# Altium project PCB_HeartRateBand.PrjPcb
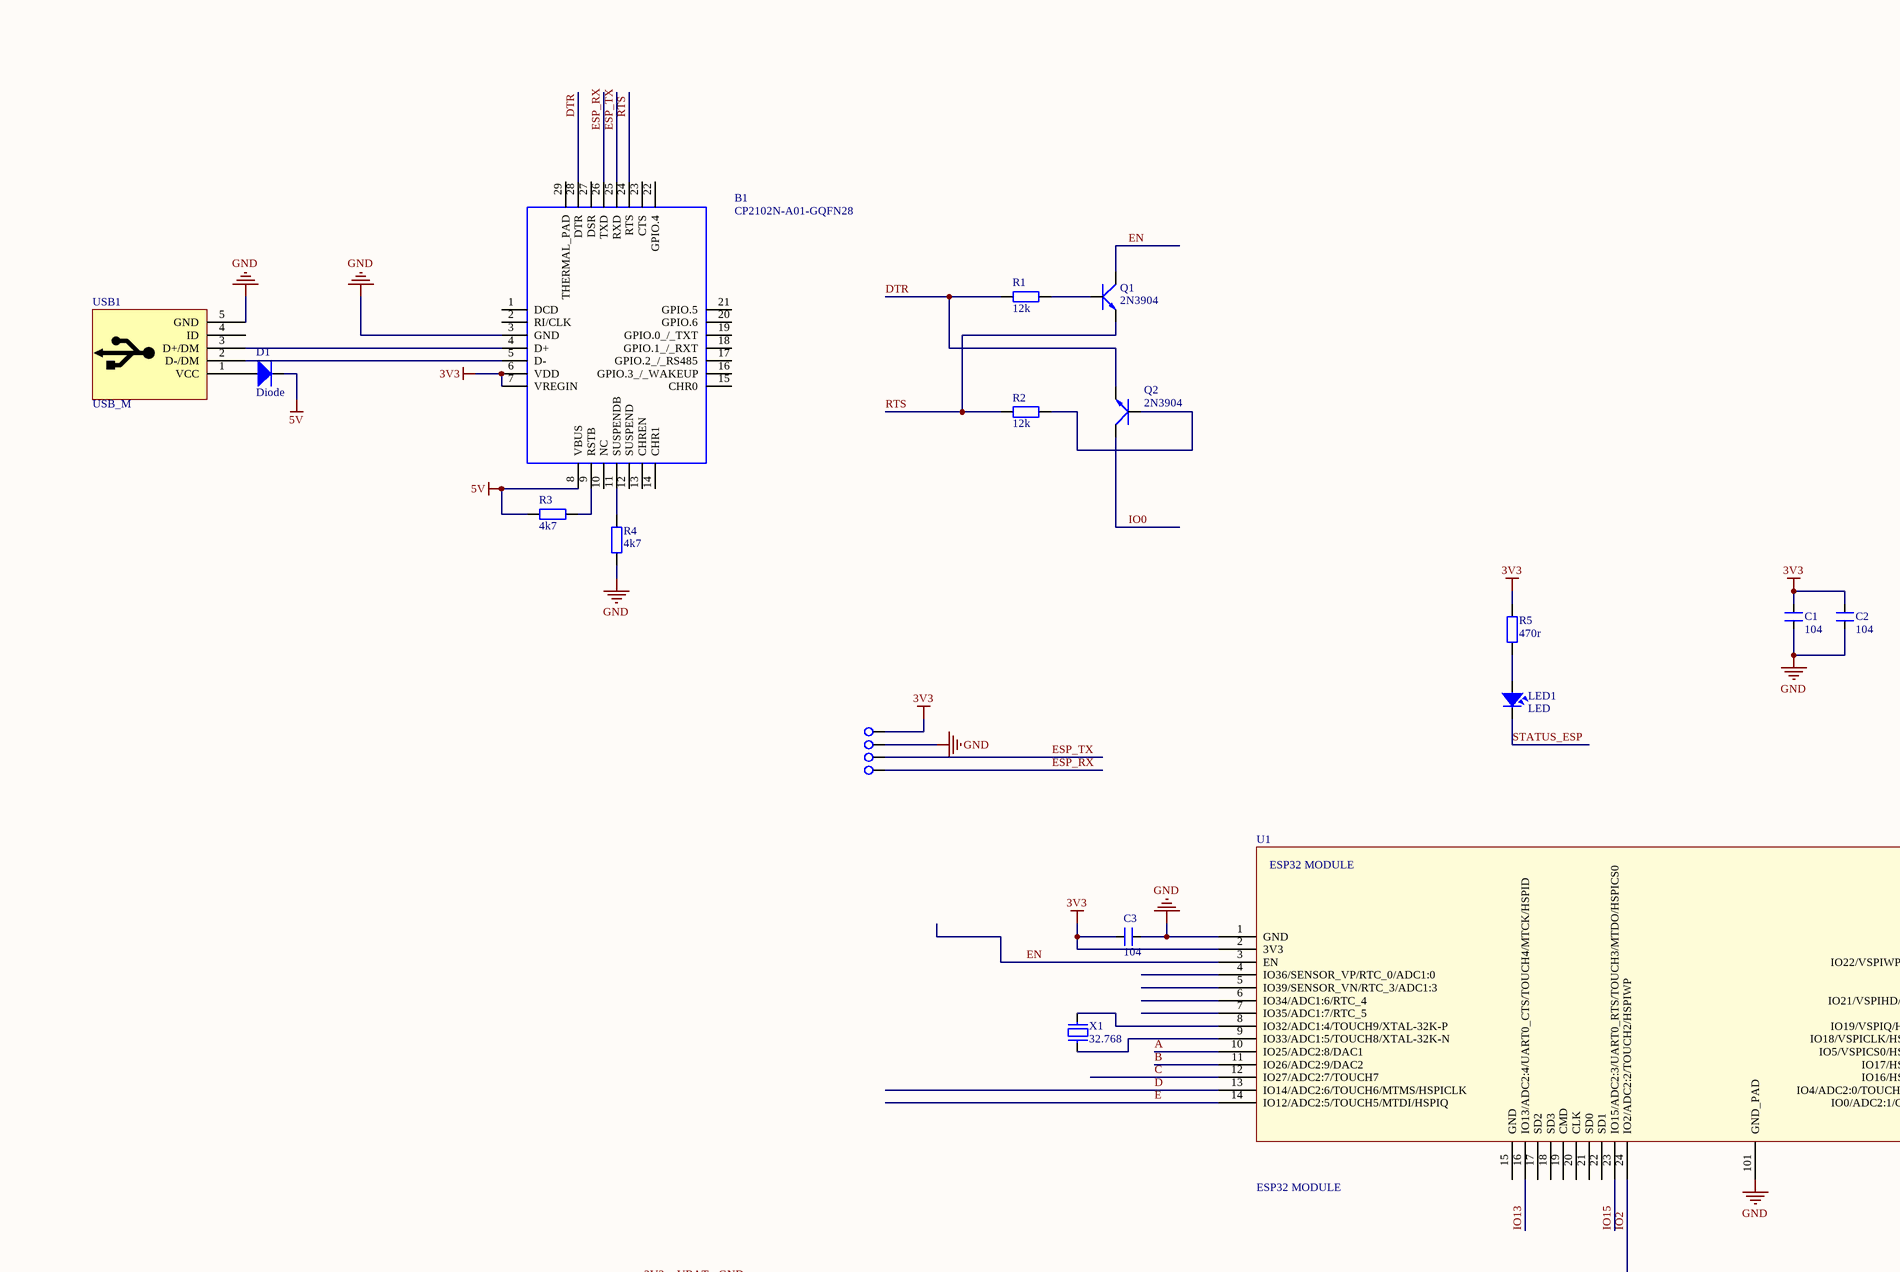
[diagram p0: HeartRateBand.SchDoc, top left]
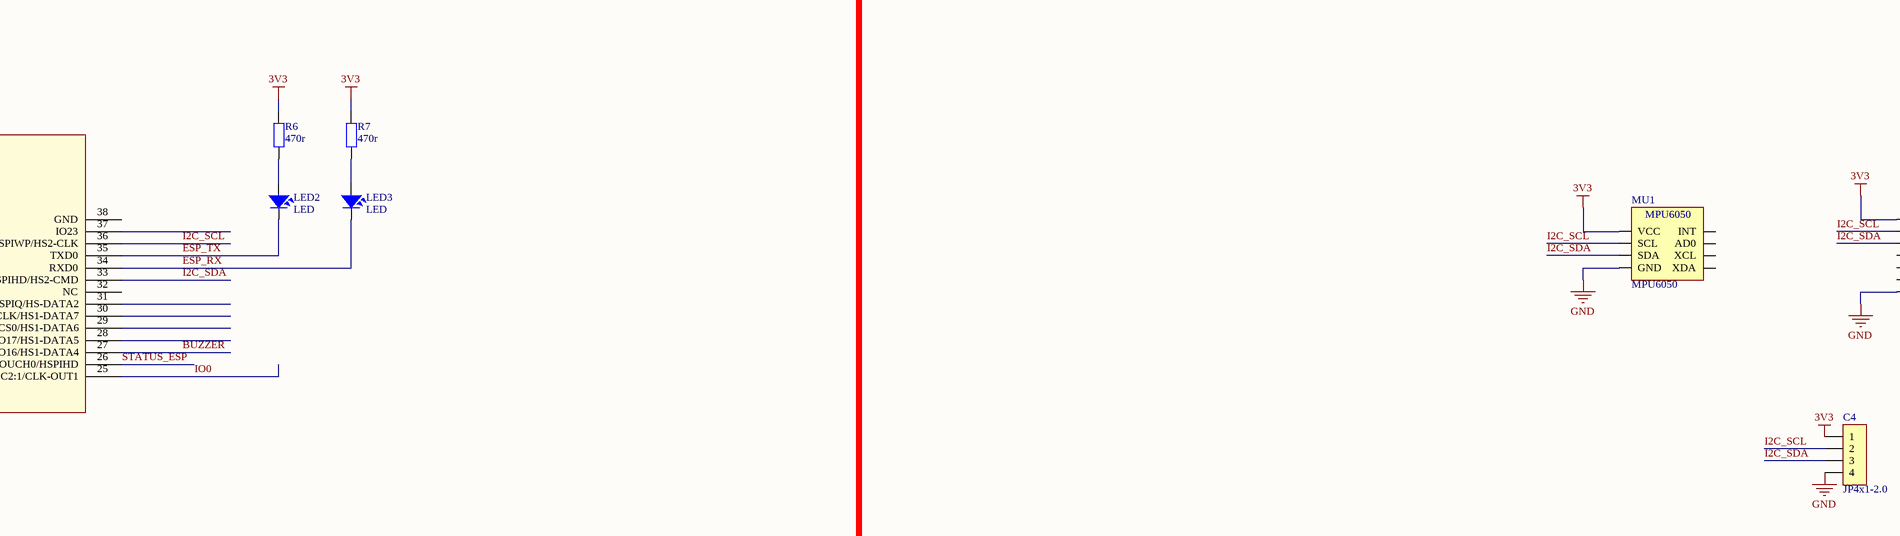
[diagram p1: HeartRateBand.SchDoc, top middle]
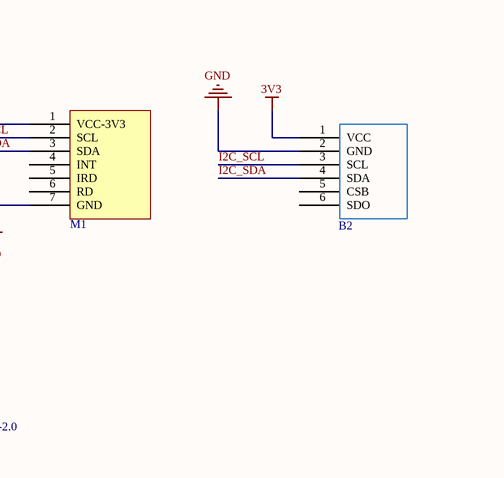
[diagram p2: HeartRateBand.SchDoc, top right]
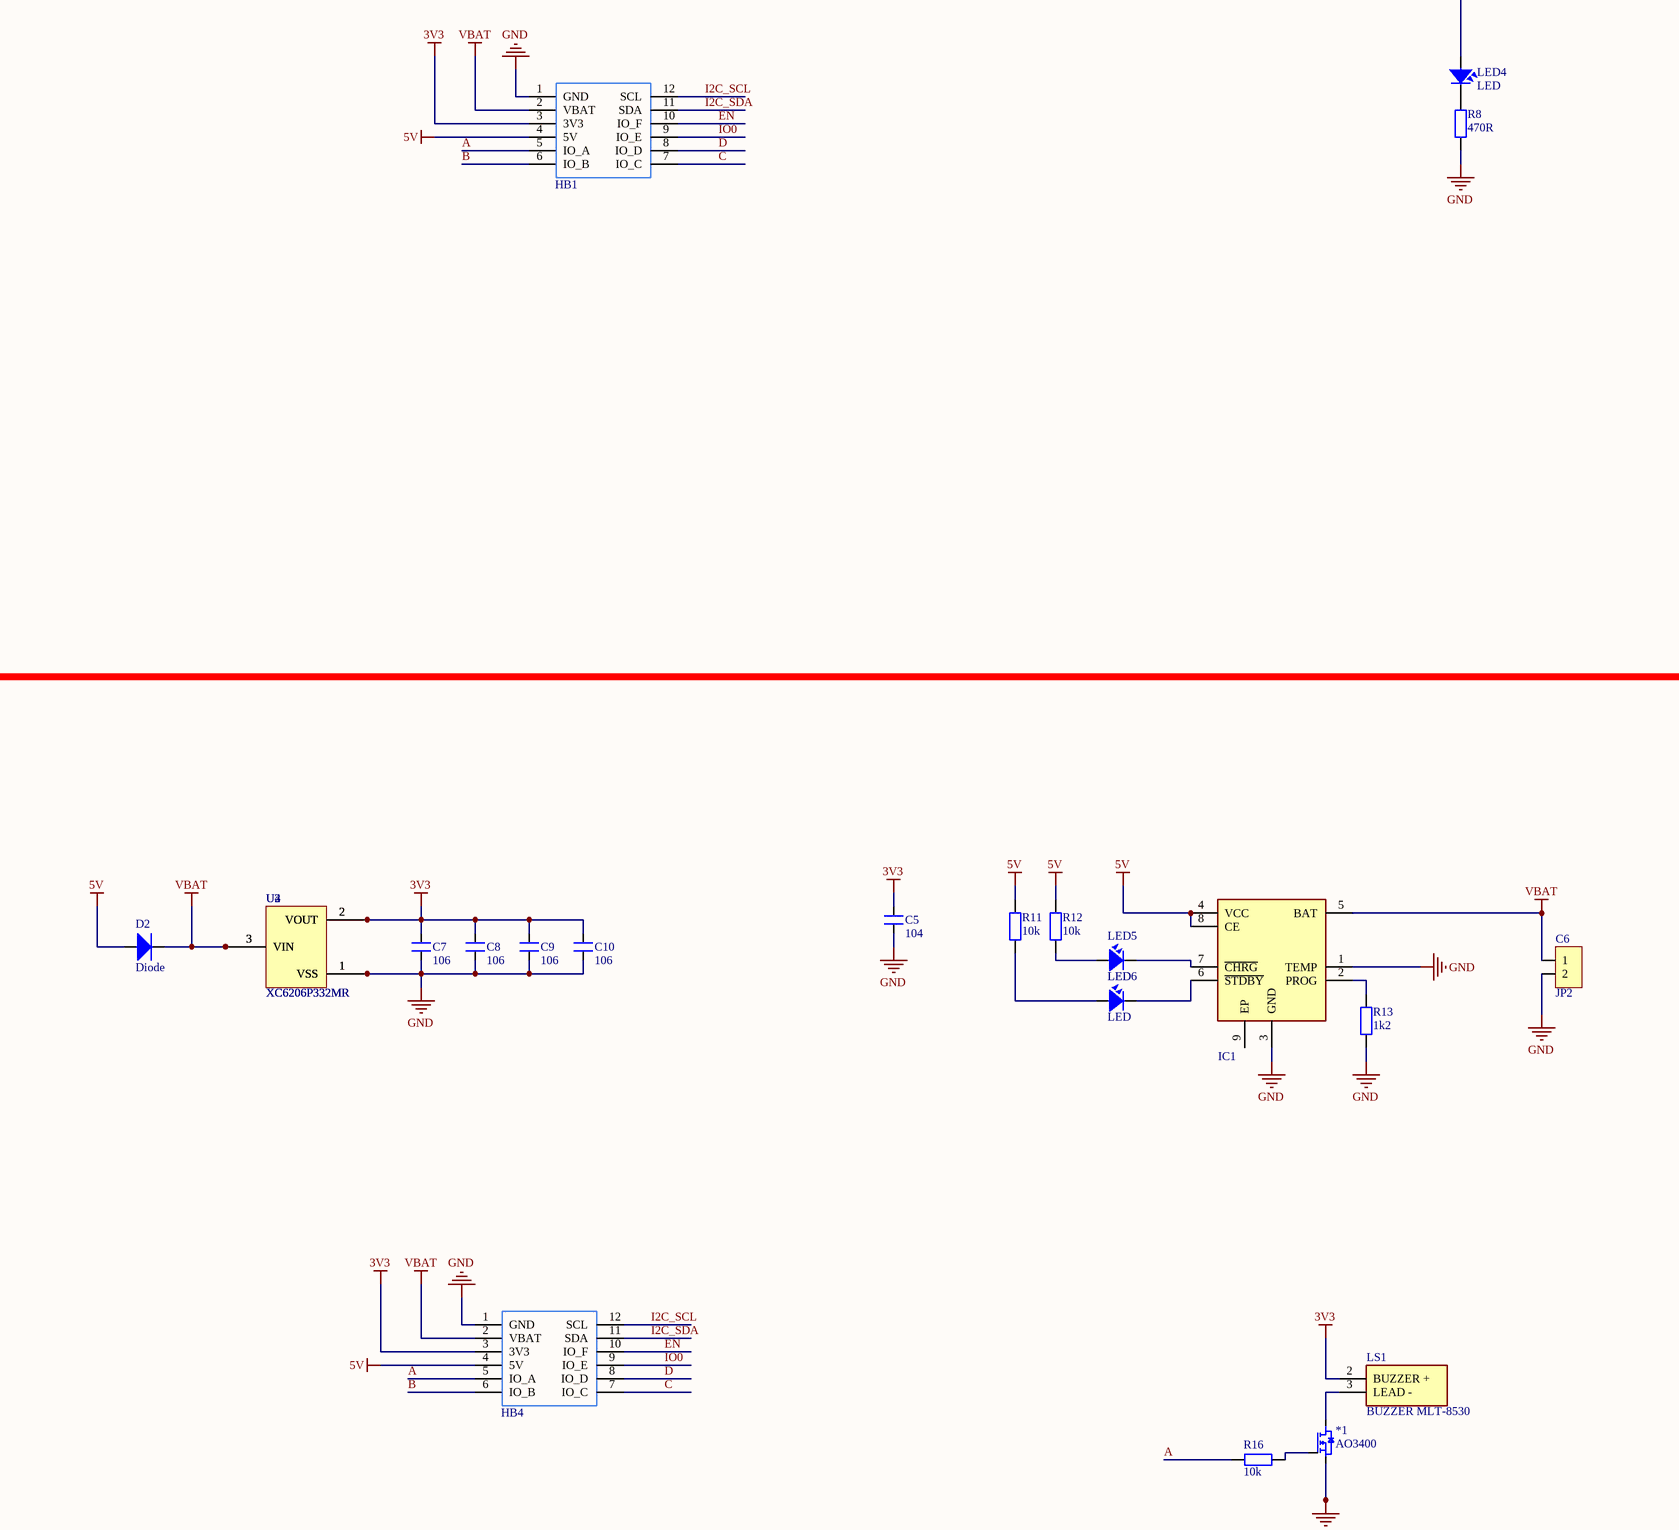
[diagram p3: HeartRateBand.SchDoc, centre left]
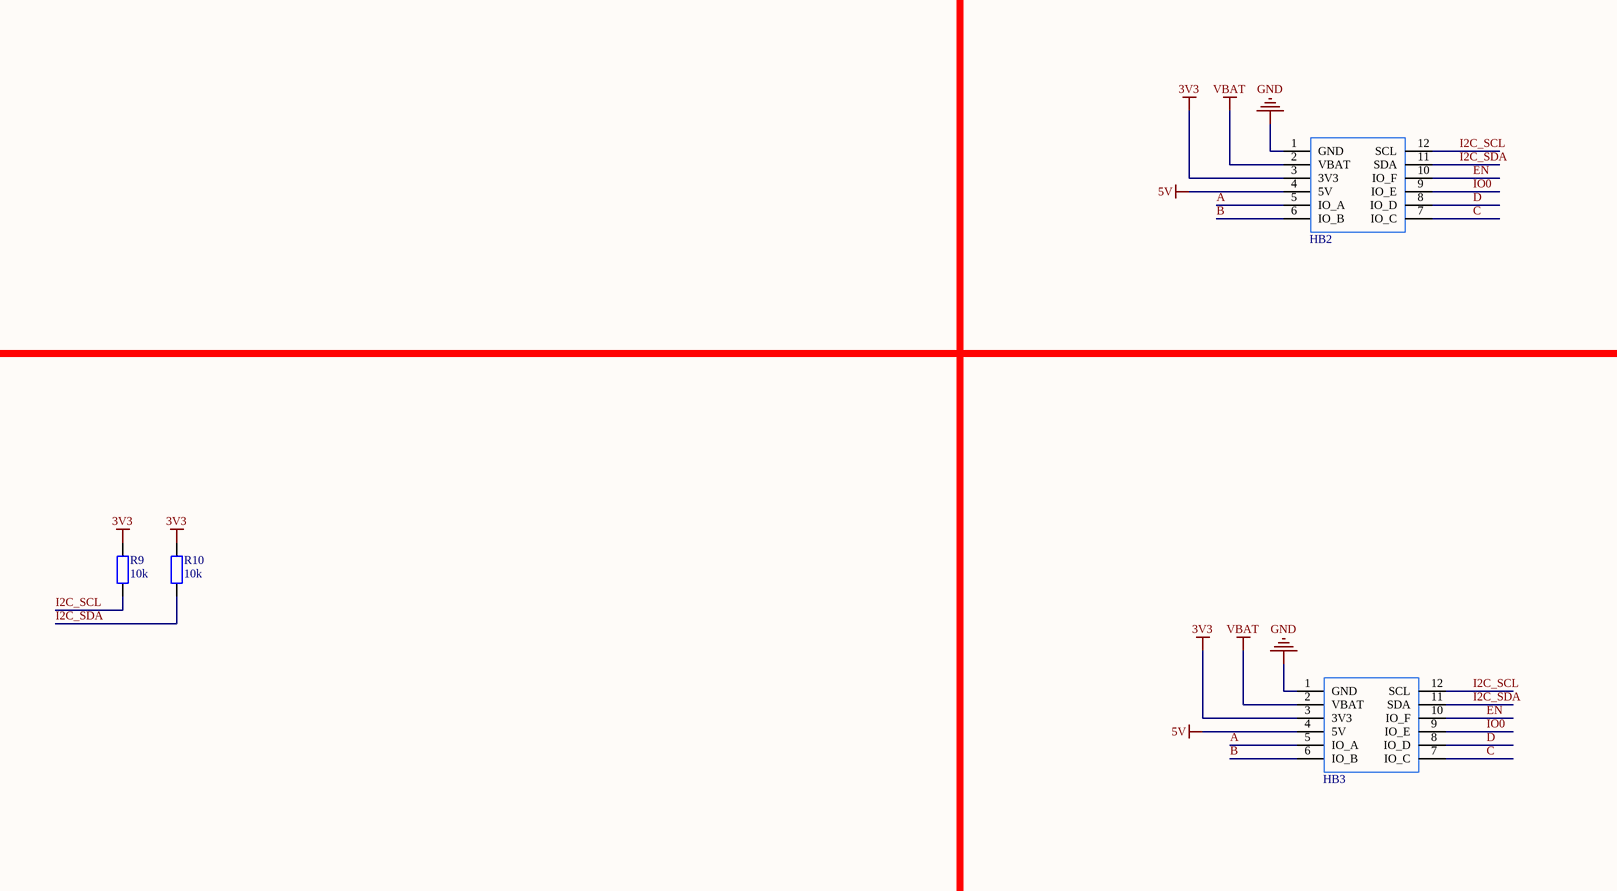
[diagram p4: HeartRateBand.SchDoc, centre middle]
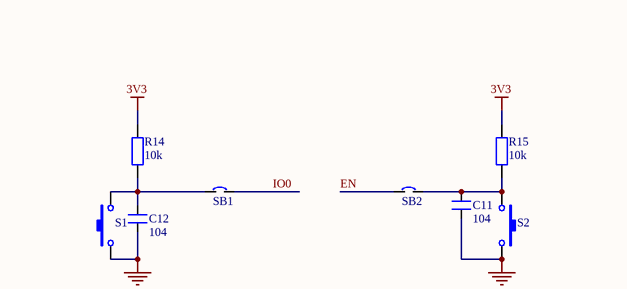
[diagram p5: HeartRateBand.SchDoc, centre right]
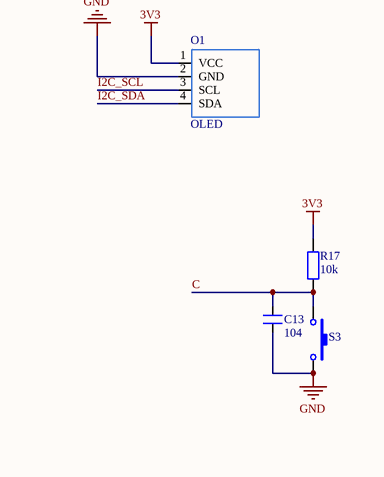
[diagram p6: HeartRateBand.SchDoc, bottom middle]
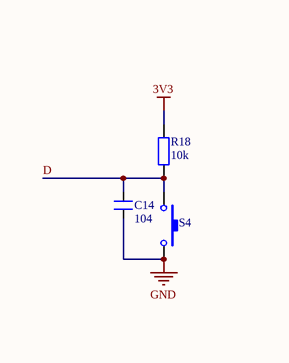
[diagram p7: HeartRateBand.SchDoc, bottom right]
1 sheet, 70 parts. Net scope: global (net labels, ports and power ports of the same name join across sheets).
Board file: HeartRateBand.PcbDoc

## Sheet HeartRateBand.SchDoc
size A0

### Parts
*1  AO3400  [SOT23-123]
*TP1  TP  [TP]  (value not drawn)
*TP2  TP  [TP]  (value not drawn)
*TP3  TP  [TP]  (value not drawn)
*TP4  TP  [TP]  (value not drawn)
B1  CP2102N-A01-GQFN28  [QFN65P600X600X100-29N-D]
B2  BMP280  [BMP280]  (value not drawn)
C1  104  [SM-0603]
C2  104  [SM-0603]
C3  104  [SM-0603]
C4  JP4x1-2.0  [J4-C1T]
C5  104  [SM-0603]
C6  JP2  [JP2-D1T]
C7  106  [SM-0603]
C8  106  [SM-0603]
C9  106  [SM-0603]
C10  106  [SM-0603]
C11  104  [SM-0603]
C12  104  [SM-0603]
C13  104  [SM-0603]
C14  104  [SM-0603]
D1  Diode  [DIO-SMD-123]
D2  Diode  [DIO-SMD-106]
HB1  HeartBand  [HeartBand]  (value not drawn)
HB2  HeartBand  [HeartBand]  (value not drawn)
HB3  HeartBand  [HeartBand]  (value not drawn)
HB4  HeartBand  [HeartBand]  (value not drawn)
IC1  TP4056-42-ESOP8  [SO-8]  (value not drawn)
LED1  LED  [SM-LED-0805-Blue]
LED2  LED  [SM-LED-0805-Blue]
LED3  LED  [SM-LED-0805-Blue]
LED4  LED  [SM-LED-0805-Blue]
LED5  LED  [SM-LED-0805-Blue]
LED6  LED  [SM-LED-0805-Blue]
LS1  BUZZER MLT-8530  [MLT8530]
M1  Mã SP: 385470  [MAX30100]  (value not drawn)
MU1  MPU6050  [MPU6050]
O1  OLED  [OLED I2C MODULE]
Q1  2N3904  [SOT23-231]
Q2  2N3904  [SOT23-231]
R1  12k  [RES-SMD-0603]
R2  12k  [RES-SMD-0603]
R3  4k7  [RES-SMD-0603]
R4  4k7  [RES-SMD-0603]
R5  470r  [RES-SMD-0603]
R6  470r  [RES-SMD-0603]
R7  470r  [RES-SMD-0603]
R8  470R  [RES-SMD-0603]
R9  10k  [RES-SMD-0603]
R10  10k  [RES-SMD-0603]
R11  10k  [RES-SMD-0603]
R12  10k  [RES-SMD-0603]
R13  1k2  [RES-SMD-0603]
R14  10k  [RES-SMD-0603]
R15  10k  [RES-SMD-0603]
R16  10k  [RES-SMD-0603]
R17  10k  [RES-SMD-0603]
R18  10k  [RES-SMD-0603]
S1  SW  [BUTTON-SMD 2PIN]  (value not drawn)
S2  SW  [BUTTON-SMD 2PIN]  (value not drawn)
S3  SW  [BUTTON-SMD 2PIN]  (value not drawn)
S4  SW  [BUTTON-SMD 2PIN]  (value not drawn)
SB1  SB  [SB]  (value not drawn)
SB2  SB  [SB]  (value not drawn)
U1  ESP32 MODULE  [ESP32S]
U2  XC6206P332MR  [SOT23-132]
U3  XC6206P332MR  [SOT23-132]
U4  XC6206P332MR  [SOT23-132]
USB1  USB_M  [USB-M1]
X1  32.768  [XT32k]

### Nets
3V3: *TP1.1 B1.6(VDD) B1.7(VREGIN) B2.1(VCC) C1.2 C2.2 C3.2 C4.1 C5.1 C7.1 C8.1 C9.1 C10.1 HB1.3(3V3) HB2.3(3V3) HB3.3(3V3) HB4.3(3V3) LS1.2(BUZZER_+) M1.1(VCC-3V3) MU1.1(VCC) O1.1(VCC) R5.2 R6.2 R7.2 R9.1 R10.1 R14.2 R15.1 R17.1 R18.1 U1.2(3V3) U2.2(VOUT) U3.2(VOUT) U4.2(VOUT)
5V: B1.8(VBUS) D1.2 D2.1 HB1.4(5V) HB2.4(5V) HB3.4(5V) HB4.4(5V) IC1.4(VCC) IC1.8(CE) R3.1 R11.1 R12.1
GND: *1.3 *TP2.1 B1.3(GND) B2.2(GND) C1.1 C2.1 C3.1 C4.4 C5.2 C6.2 C7.2 C8.2 C9.2 C10.2 C11.1 C12.2 C13.1 C14.1 HB1.1(GND) HB2.1(GND) HB3.1(GND) HB4.1(GND) IC1.1(TEMP) IC1.3(GND) M1.7(GND) MU1.2(GND) O1.2(GND) R4.1 R8.2 R13.2 S1.1 S2.2 S3.2 S4.2 U1.1(GND) U1.101(GND_PAD) U2.1(VSS) U3.1(VSS) U4.1(VSS) USB1.5(GND)
VBAT: C6.1 D2.2 HB1.2(VBAT) HB2.2(VBAT) HB3.2(VBAT) HB4.2(VBAT) IC1.5(BAT) U2.3(VIN) U3.3(VIN) U4.3(VIN)
A: HB1.5(IO_A) HB2.5(IO_A) HB3.5(IO_A) HB4.5(IO_A) R16.2 U1.10(IO25/ADC2:8/DAC1)
B: HB1.6(IO_B) HB2.6(IO_B) HB3.6(IO_B) HB4.6(IO_B) U1.11(IO26/ADC2:9/DAC2)
BUZZER: U1.27(IO16/HS1-DATA4)
C: C13.2 HB1.7(IO_C) HB2.7(IO_C) HB3.7(IO_C) HB4.7(IO_C) R17.2 S3.1 U1.12(IO27/ADC2:7/TOUCH7)
D: C14.2 HB1.8(IO_D) HB2.8(IO_D) HB3.8(IO_D) HB4.8(IO_D) R18.2 S4.1 U1.13(IO14/ADC2:6/TOUCH6/MTMS/HSPICLK)
DTR: B1.28(DTR) Q2.1(E) R1.2
E: U1.14(IO12/ADC2:5/TOUCH5/MTDI/HSPIQ)
EN: HB1.10(IO_F) HB2.10(IO_F) HB3.10(IO_F) HB4.10(IO_F) Q1.3(C) SB2.1 U1.3(EN)
ESP_RX: *TP4.1 B1.26(TXD) LED3.2 U1.34(RXD0)
ESP_TX: *TP3.1 B1.25(RXD) LED2.2 U1.35(TXD0)
I2C_SCL: B2.3(SCL) C4.2 HB1.12(SCL) HB2.12(SCL) HB3.12(SCL) HB4.12(SCL) M1.2(SCL) MU1.3(SCL) O1.3(SCL) R9.2 U1.36(IO22/VSPIWP/HS2-CLK)
I2C_SDA: B2.4(SDA) C4.3 HB1.11(SDA) HB2.11(SDA) HB3.11(SDA) HB4.11(SDA) M1.3(SDA) MU1.4(SDA) O1.4(SDA) R10.2 U1.33(IO21/VSPIHD/HS2-CMD)
IO0: HB1.9(IO_E) HB2.9(IO_E) HB3.9(IO_E) HB4.9(IO_E) Q2.3(C) SB1.2 U1.25(IO0/ADC2:1/CLK-OUT1)
IO2: LED4.1 U1.24(IO2/ADC2:2/TOUCH2/HSPIWP)
IO13: U1.16(IO13/ADC2:4/UART0_CTS/TOUCH4/MTCK/HSPID)
IO15: U1.23(IO15/ADC2:3/UART0_RTS/TOUCH3/MTDO/HSPICS0)
RTS: B1.24(RTS) Q1.1(E) R2.2
STATUS_ESP: LED1.2 U1.26(IO4/ADC2:0/TOUCH0/HSPIHD)
Net*1_1: *1.1 R16.1
Net*1_2: *1.2 LS1.3(LEAD_-)
NetB1_4: B1.4(D+) USB1.3(D+/DM)
NetB1_5: B1.5(D-) USB1.2(D-/DM)
NetB1_9: B1.9(RSTB) R3.2
NetB1_11: B1.11(SUSPENDB) R4.2
NetC11_2: C11.2 R15.2 S2.1 SB2.2
NetC12_1: C12.1 R14.1 S1.2 SB1.1
NetD1_1: D1.1 USB1.1(VCC)
NetIC1_2: IC1.2(PROG) R13.1
NetIC1_6: IC1.6(~{STDBY}) LED6.2
NetIC1_7: IC1.7(~{CHRG}) LED5.2
NetLED1_1: LED1.1 R5.1
NetLED2_1: LED2.1 R6.1
NetLED3_1: LED3.1 R7.1
NetLED4_2: LED4.2 R8.1
NetLED5_1: LED5.1 R12.2
NetLED6_1: LED6.1 R11.2
NetQ1_2: Q1.2(B) R1.1
NetQ2_2: Q2.2(B) R2.1
NetU1_8: U1.8(IO32/ADC1:4/TOUCH9/XTAL-32K-P) X1.2
NetU1_9: U1.9(IO33/ADC1:5/TOUCH8/XTAL-32K-N) X1.1

Not connected (* = marked no-connect by the designer): B1 1(DCD) 2(RI/CLK) 10(NC) 12(SUSPEND) 13(CHREN) 14(CHR1) 15(CHR0) 16(GPIO.3_/_WAKEUP) 17(GPIO.2_/_RS485) 18(GPIO.1_/_RXT) 19(GPIO.0_/_TXT) 20(GPIO.6) 21(GPIO.5) 22(GPIO.4) 23(CTS) 27(DSR) 29(THERMAL_PAD); B2 5(CSB) 6(SDO); IC1 9(EP); M1 4(INT) 5(IRD) 6(RD); MU1 5(XDA) 6(XCL) 7(AD0) 8(INT); U1 4(IO36/SENSOR_VP/RTC_0/ADC1:0) 5(IO39/SENSOR_VN/RTC_3/ADC1:3) 6(IO34/ADC1:6/RTC_4) 7(IO35/ADC1:7/RTC_5) 15(GND) 17(SD2) 18(SD3) 19(CMD) 20(CLK) 21(SD0) 22(SD1) 28(IO17/HS1-DATA5) 29(IO5/VSPICS0/HS1-DATA6) 30(IO18/VSPICLK/HS1-DATA7) 31(IO19/VSPIQ/HS-DATA2) 32(NC) 37(IO23) 38(GND); USB1 4(ID)

### Library data of the parts
B1 = CP2102N-A01-GQFN28: SILICON LABS - CP2102N-A01-GQFN28 - USB-UART INTERFACE BRIDGE, QFN-28; Geometry.Height: 0.8mm; Manufacturer_Name: Silicon Labs; Manufacturer_Part_Number: CP2102N-A01-GQFN28; RS Part Number: *; RS Price/Stock: *; Arrow Part Number: CP2102N-A01-GQFN28; Arrow Price/Stock: https://www.arrow.com/en/products/cp2102n-a01-gqfn28/silicon-labs; Datasheet Link: http://www.farnell.com/datasheets/2245279.pdf
B2 = BMP280: https://iotmaker.vn/cam-bien-ap-suat-bmp280.html
C1-C3 C5 C7-C14 = CM: Cap SMD; Value: 103
C4 = JP4x1-2.0: WR-PHD 2.00 mm Socket Header; Manufacturer: W¨¹rth Elektronik eiSos GmbH; partNo: 62000411821; ComponentLink1 Description: Manufacturer; ComponentLink2 Description: Datasheet; NoPins: 04; Created Date: 2 April 2013; ComponentLink1URL: http://www.we-online.com; ComponentLink2URL: http://katalog.we-online.de/em/datasheet/6200xx11821.pdf; Created by: Karrer Zheng
C6 = JP2: WR-PHD 2.54 mm Angled Socket Header; Manufacturer: W¨¹rth Elektronik eiSos GmbH; partNo: 613002143121; ComponentLink1 Description: Manufacturer; ComponentLink2 Description: Datasheet; NoPins: 02; Created Date: 29 March 2013; ComponentLink1URL: http://www.we-online.com; ComponentLink2URL: http://katalog.we-online.de/em/datasheet/6130xx143121.pdf; Created by: Karrer Zheng
IC1 = TP4056-42-ESOP8: Integrated Circuit; Manufacturer_Name: Nanjing Extension Microelectronics; Datasheet Link: https://datasheet.lcsc.com/szlcsc/1906261508_Nanjing-Extension-Microelectronics-TP4056-42-ESOP8_C16581.pdf; Height: 1.75mm; Manufacturer_Part_Number: TP4056-42-ESOP8
LS1 = BUZZER MLT-8530: Loudspeaker or Buzzer; Manufacturer_Name: Jiangsu Huaneng Elec; Datasheet Link: https://datasheet.lcsc.com/szlcsc/1811182003_Jiangsu-Huaneng-Elec-MLT-8530_C94599.pdf; Height: 3mm; Manufacturer_Part_Number: MLT-8530
M1 = MAX30100_HeartRateSensor: http://linhkienviet.vn/cam-bien-nhip-tim-va-oxy-trong-mau-max30100-max30100-pulse-oximeter-and-heart-rate
MU1 = MPU6050: Manufacturer: W¨¹rth Elektronik eiSos GmbH; partNo: 613004143121; ComponentLink1 Description: Manufacturer; ComponentLink2 Description: Datasheet; NoPins: 04; Created Date: 29 March 2013; ComponentLink1URL: http://www.we-online.com; ComponentLink2URL: http://katalog.we-online.de/em/datasheet/6130xx143121.pdf; Created by: Karrer Zheng
O1 = OLED I2C MODULE
Q1 Q2 = 2N3904: NPN 600mW, ECB; Value: C1815
R1-R18 = R: Resistor R1/4W
S1-S4 = SW-Button: Switch-Button; Published: 24-Mar-1999; LatestRevisionDate: 17-Jul-2002; LatestRevisionNote: Re-released for DXP Platform.; PackageReference: SPST-2; Publisher: Altium Limited
U2-U4 = XC6206P332MR: 3V3/0.5A
X1 = XT2: Crystal, 32.768 KHz, -40 to 85 degC, 3.2 x 1.5 x 0.9 mm SMD; Value: 4Mhz